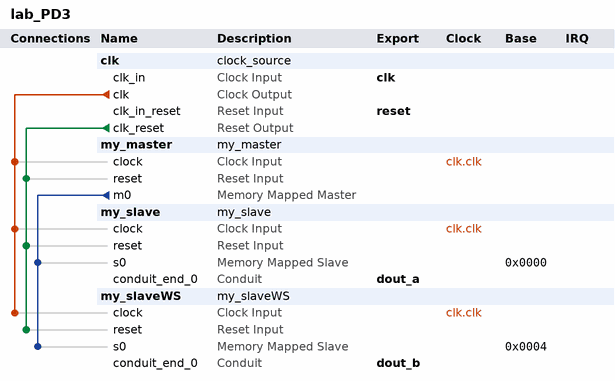
[diagram p0: system contents]
# Platform Designer (Qsys) system lab_PD3, Cyclone IV E EP4CE115F29C8
# Parameters at their usual value, and those the tool derives, are not listed.
package require -exact qsys 20.1
create_system lab_PD3
set_project_property DEVICE_FAMILY {Cyclone IV E}
set_project_property DEVICE EP4CE115F29C8

add_instance clk clock_source 20.1
set_instance_parameter_value clk clockFrequency 50000000
set_instance_parameter_value clk resetSynchronousEdges DEASSERT

add_instance my_master my_master 1.0
set_instance_parameter_value my_master address_1 0
set_instance_parameter_value my_master address_2 4
set_instance_parameter_value my_master data_1 287454020
set_instance_parameter_value my_master data_2 61166

add_instance my_slave my_slave 1.0

add_instance my_slaveWS my_slaveWS 1.0

# connections
add_connection clk.clk my_master.clock clock
add_connection clk.clk my_slave.clock clock
add_connection clk.clk my_slaveWS.clock clock
add_connection clk.clk_reset my_master.reset reset
add_connection clk.clk_reset my_slave.reset reset
add_connection clk.clk_reset my_slaveWS.reset reset
add_connection my_master.m0 my_slave.s0 avalon
set_connection_parameter_value my_master.m0/my_slave.s0 baseAddress 0x0000
add_connection my_master.m0 my_slaveWS.s0 avalon
set_connection_parameter_value my_master.m0/my_slaveWS.s0 baseAddress 0x0004

# exported interfaces
add_interface clk clock sink
set_interface_property clk EXPORT_OF clk.clk_in
add_interface dout_a conduit end
set_interface_property dout_a EXPORT_OF my_slave.conduit_end_0
add_interface dout_b conduit end
set_interface_property dout_b EXPORT_OF my_slaveWS.conduit_end_0
add_interface reset reset sink
set_interface_property reset EXPORT_OF clk.clk_in_reset

set_interconnect_requirement {$system} qsys_mm.clockCrossingAdapter HANDSHAKE
set_interconnect_requirement {$system} qsys_mm.enableEccProtection FALSE
set_interconnect_requirement {$system} qsys_mm.insertDefaultSlave FALSE
set_interconnect_requirement {$system} qsys_mm.maxAdditionalLatency 1

save_system lab_PD3.qsys
